# EAGLE design emonGLCD_V1.5 (EAGLE 6.5.0)
ABBREV: tx1; DRAWING_AUTHOR: Glyn Husdson; PROJECT: EmonTx V1.0
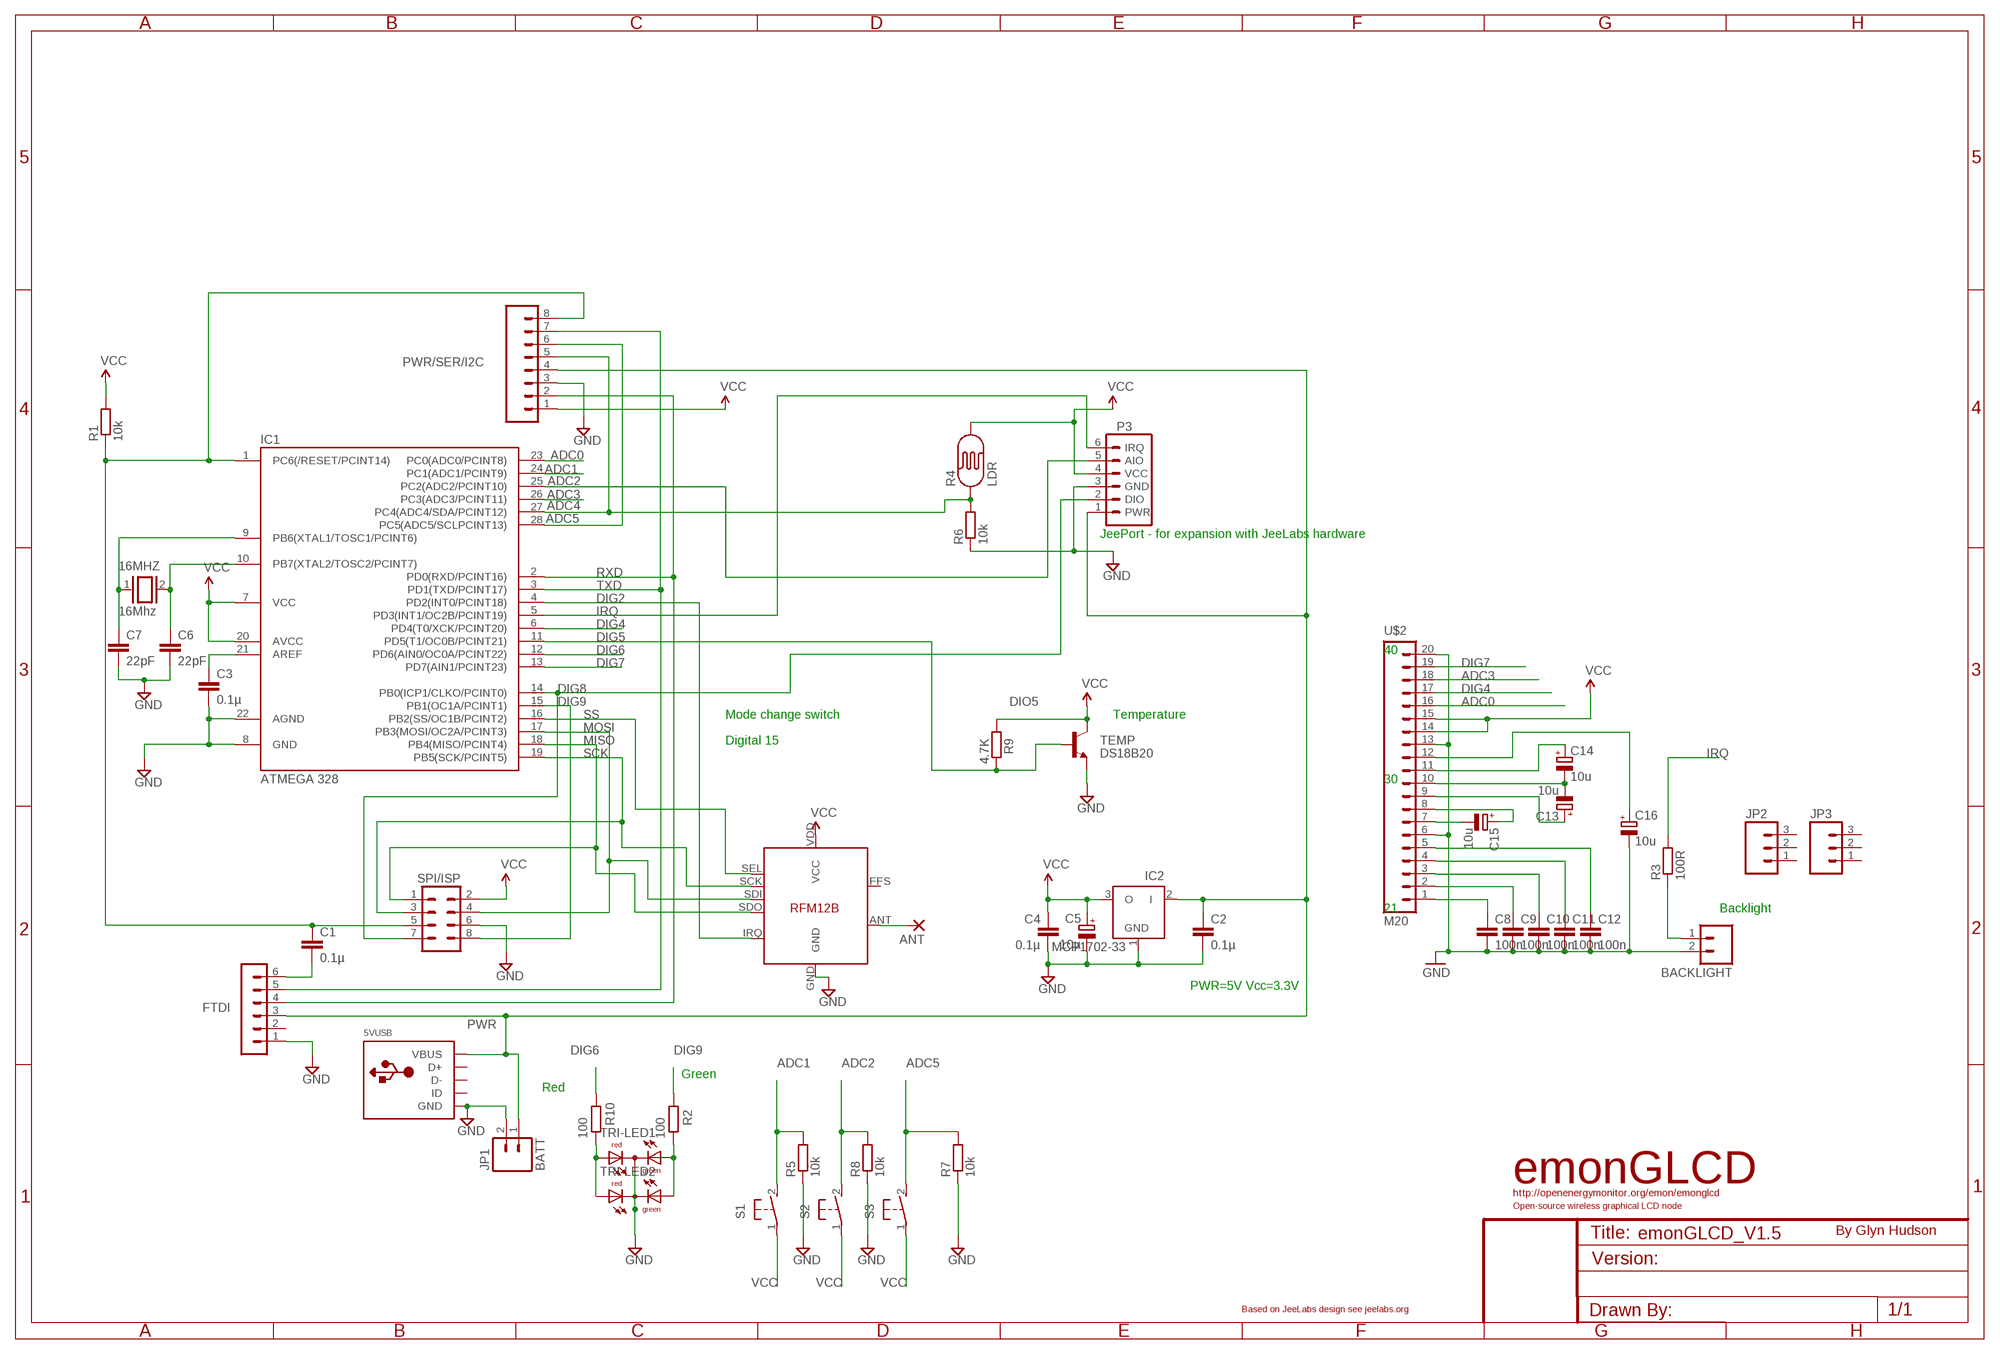
[diagram p0: schematic, sheet 1]

## Parts
5VUSB  USBMOLEX  [USB-MINIB-THM-MOLEX]
16MHZ  16Mhz  XTAL/S  [QS]
ANT  1,6/0,8  [1,6/0,8]
BACKLIGHT  M02PTH  [1X02]
C1  0.1µ  C-EU025-024X044  [C025-024X044]
C2  0.1µ  C-EU025-024X044  [C025-024X044]
C3  0.1µ  C-EU025-024X044  [C025-024X044]
C4  0.1µ  C-EU025-024X044  [C025-024X044]
C5  10µ  CPOL-EUE1.8-4  [E1,8-4]
C6  22pF  C2.5/2  [C2.5-2]
C7  22pF  C2.5/2  [C2.5-2]
C8  100n  C2.5/2  [C2.5-2]
C9  100n  C2.5/2  [C2.5-2]
C10  100n  C2.5/2  [C2.5-2]
C11  100n  C2.5/2  [C2.5-2]
C12  100n  C2.5/2  [C2.5-2]
C13  10u  CPOL-EUE1.8-4  [E1,8-4]
C14  10u  CPOL-EUE1.8-4  [E1,8-4]
C15  10u  CPOL-EUE1.8-4  [E1,8-4]
C16  10u  CPOL-EUE1.8-4  [E1,8-4]
FTDI  FTDI  MA06-1  [MA06-1]
IC1  ATMEGA 328  ATMEGA48/88/168-PU  [DIL28-3]
IC2  MCP1702-33  MCP1702Z  [TO92]
JP1  BATT  M02LOCK_LONGPADS  [1X02_LOCK_LONGPADS]
JP2  M03PTH  [1X03]
JP3  M03PTH  [1X03]
P3  JEEPORT  JEEPORT-LONGPADS  [PORT6PIN]
PWR/SER/I2C  M08  [1X08]
R1  10k  R-EU_0204/7  [0204/7]
R2  100  R-EU_0204/7  [0204/7]
R3  100R  R-EU_0204/7  [0204/7]
R4  LDR  PHOTOCELLPTH  [PHOTOCELL]
R5  10k  R-EU_0204/7  [0204/7]
R6  10k  R-EU_0204/7  [0204/7]
R7  10k  R-EU_0204/7  [0204/7]
R8  10k  R-EU_0204/7  [0204/7]
R9  4.7K  R-EU_0204/7  [0204/7]
R10  100  R-EU_0204/7  [0204/7]
S1  31-XX  [B3F-31XX]
S2  31-XX  [B3F-31XX]
S3  31-XX  [B3F-31XX]
SV7  SPI/ISP  MA04-2  [MA04-2]
TEMP  DS18B20  TRANSISTOR_NPNTO92  [TO-92]
TRI-LED1  DUOLED5MM  [DUOLED5MM]
TRI-LED2  DUOLED5MM  [DUOLED5MM]
U$1  RFM12B  [RFM12B]
U$2  M20  [1X20]

## Nets
ADC0: IC1.23(PC0(ADC0/PCINT8)) U$2.16
ADC1: IC1.24(PC1(ADC1/PCINT9)) R5.2 S1.2(S)
ADC2: IC1.25(PC2(ADC2/PCINT10)) P3.5(AIO) R8.2 S2.2(S)
ADC3: IC1.26(PC3(ADC3/PCINT11)) U$2.18
ADC4: IC1.27(PC4(ADC4/SDA/PCINT12)) PWR/SER/I2C.5 R4.1 R6.2
ADC5: IC1.28(PC5(ADC5/SCLPCINT13)) PWR/SER/I2C.6 R7.2 S3.2(S)
DIG2: IC1.4(PD2(INT0/PCINT18)) U$1.IRQ
DIG4 [power]: IC1.6(PD4(T0/XCK/PCINT20)) U$2.17
DIG5: IC1.11(PD5(T1/OC0B/PCINT21)) R9.2 TEMP.2(B)
DIG6: IC1.12(PD6(AIN0/OC0A/PCINT22)) R10.2
DIG7: IC1.13(PD7(AIN1/PCINT23)) U$2.19
DIG8: IC1.14(PB0(ICP1/CLKO/PCINT0)) P3.2(DIO) SV7.7
DIG9: IC1.15(PB1(OC1A/PCINT1)) R2.2 SV7.8
GND [power]: 5VUSB.GND BACKLIGHT.2 C2.2 C3.2 C4.2 C5.- C6.2 C7.2 C8.2 C9.2 C10.2 C11.2 C12.2 C16.- FTDI.1 IC1.8(GND) IC1.22(AGND) IC2.1(GND) JP1.2 P3.3(GND) PWR/SER/I2C.3 R5.1 R6.1 R7.1 R8.1 SV7.6 TEMP.1(E) TRI-LED1.K(C) TRI-LED2.K(C) U$1.GND U$2.6 U$2.13 U$2.20
IRQ: IC1.5(PD3(INT1/OC2B/PCINT19)) P3.6(IRQ) R3.2
MISO: IC1.18(PB4(MISO/PCINT4)) SV7.1 U$1.SDO
MOSI: IC1.17(PB3(MOSI/OC2A/PCINT3)) SV7.4 U$1.SDI
N$1: 16MHZ.2 C6.1 IC1.10(PB7(XTAL2/TOSC2/PCINT7))
N$2: C8.1 U$2.1
N$3: C9.1 U$2.2
N$4: C13.- C14.- U$2.10
N$5: C10.1 U$2.3
N$6: C11.1 U$2.4
N$7: C12.1 U$2.5
N$8: R10.1 TRI-LED1.AR TRI-LED2.AR
N$12: 16MHZ.1 C7.1 IC1.9(PB6(XTAL1/TOSC1/PCINT6))
N$13: ANT.1(P) U$1.ANT
N$14: R2.1 TRI-LED1.AG TRI-LED2.AG
N$15: C1.2 FTDI.6
N$17: BACKLIGHT.1 R3.1
N$19: C3.1 IC1.21(AREF)
N$20: C14.+ U$2.11
N$22: C13.+ U$2.9
N$23: C15.- U$2.7
N$27: C15.+ U$2.8
N$28: C16.+ U$2.12
PWR [power]: 5VUSB.VBUS C2.1 FTDI.3 IC2.2(I) JP1.1 P3.1(PWR) PWR/SER/I2C.4
RST: C1.1 IC1.1(PC6(/RESET/PCINT14)) PWR/SER/I2C.8 R1.1 SV7.5
RXD: FTDI.4 IC1.2(PD0(RXD/PCINT16)) PWR/SER/I2C.2
SCK: IC1.19(PB5(SCK/PCINT5)) SV7.3 U$1.SCK
SS: IC1.16(PB2(SS/OC1B/PCINT2)) U$1.SEL
TXD: FTDI.5 IC1.3(PD1(TXD/PCINT17)) PWR/SER/I2C.7
VCC [power]: C4.1 C5.+ IC1.7(VCC) IC1.20(AVCC) IC2.3(O) P3.4(VCC) PWR/SER/I2C.1 R1.2 R4.2 R9.1 S1.1(P) S2.1(P) S3.1(P) SV7.2 TEMP.3(C) U$1.VDD(VCC) U$2.14 U$2.15
Unconnected: 5VUSB.D+ 5VUSB.D- 5VUSB.ID FTDI.2 JP2.1 JP2.2 JP2.3 JP3.1 JP3.2 JP3.3 U$1.FFS

## Notes on the sheet
- JeePort - for expansion with JeeLabs hardware
- 40
- DIO5
- Mode change switch | Temperature
- Digital 15
- 30
- 21 | Backlight
- PWR=5V Vcc=3.3V
- Green
- Red
- emonGLCD
- http://openenergymonitor.org/emon/emonglcd
- Open-source wireless graphical LCD node
- By Glyn Hudson
- Based on JeeLabs design see jeelabs.org

## Library data of the parts
5VUSB = adafruit:USB: USB Connectors USBMINIB - Surface Mount Female Mini-B USB Connector 4UConnector: 06564 By microbuilder.eu Thru-hole RA Female Mini-B USB Connector 4UConnector: 18732 By ladyada.net
16MHZ = special:XTAL/S: CRYSTAL
ANT = JeeLabs:1,6/0,8: THROUGH-HOLE PAD
BACKLIGHT JP1 = SparkFun:M02: Header 2 Standard 2-pin 0.1" header. Use with straight break away headers (SKU : PRT-00116), right angle break away headers (PRT-00553), swiss pins (PRT-00743), machine pins (PRT-00117), and female headers (PRT-00115). Molex polarized connector foot print use with SKU : PRT-08233 with associated crimp pins and housings.
C1-C4 = resistor:C-EU: CAPACITOR, European symbol
C5 C13-C16 = resistor:CPOL-EU: POLARIZED CAPACITOR, European symbol
C6-C12 = capacitor-wima:C: CAPACITOR naming: grid - package width
FTDI = JeeLabs:MA06-1: PIN HEADER
IC1 = atmega8:ATMEGA48/88/168-PU
IC2 = JeeLabs:MCP1702: 200 mA, Low Power Low Dropout Voltage Regulator
JP2 JP3 = SparkFun:M03: Header 3 Standard 3-pin 0.1" header. Use with straight break away headers (SKU : PRT-00116), right angle break away headers (PRT-00553), swiss pins (PRT-00743), machine pins (PRT-00117), and female headers (PRT-00115). Molex polarized connector foot print use with SKU : PRT-08232 with associated crimp pins and housings.
P3 = JeeParts:JEEPORT: PIN HEADER
PWR/SER/I2C = SparkFun:M08: Header 8 Standard 8-pin 0.1" header. Use with straight break away headers (SKU : PRT-00116), right angle break away headers (PRT-00553), swiss pins (PRT-00743), machine pins (PRT-00117), and female headers (PRT-00115).
R1 R5-R8 = resistor:R-EU_: RESISTOR, European symbol
R2 R3 R9 R10 = rcl:R-EU_: RESISTOR, European symbol
R4 = SparkFun:PHOTOCELL: Photocell Also known as a CdS photoresistor. This is a low cost way to detect light levels. Resistance decreases with more incoming light. SparkFun SKU: SEN-09088
S1-S3 = switch-omron:31-XX: OMRON SWITCH
SV7 = JeeLabs:MA04-2: PIN HEADER
TEMP = SparkFun:TRANSISTOR_NPN: Transistor NPN BJT configuration in SOT23 package. MMBT2222 is the common NPN we use. Double check BCE configuration again layout.
TRI-LED1 TRI-LED2 = led:DUOLED5MM: DUO LED 2 colors, 5 mm, round
U$1 = JeeLabs:RFM12B
U$2 = SparkFun:M20: This is just like the LOCK variant in that the holes are staggared by 5 mil, but except for the last two holes. They are not altered from the "standard" footprint layout. This is used for a special purpose on the layout of our Graphic LCD Backpack. Make sure you want to use this device before selecting it for you project!

## Net classes
0 default: width 0.254 mm, drill 0.6 mm, clearance 0.254 mm
1 power: width 0.305 mm, drill 0.6 mm, clearance 0.254 mm

## Board
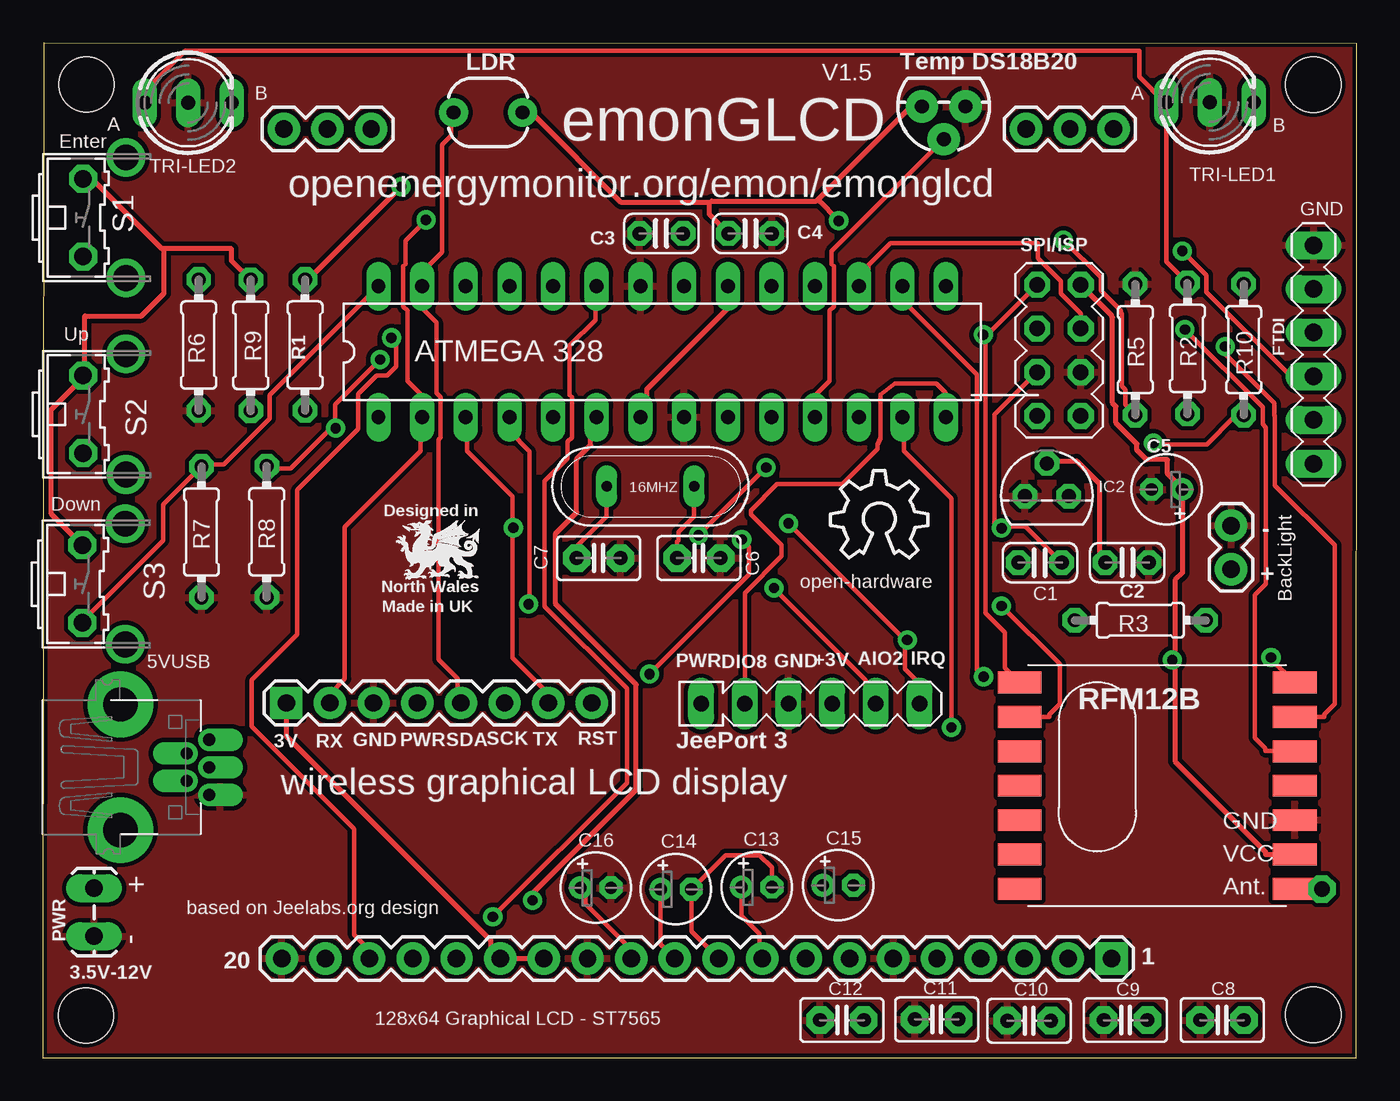
[diagram p1: board, top side]
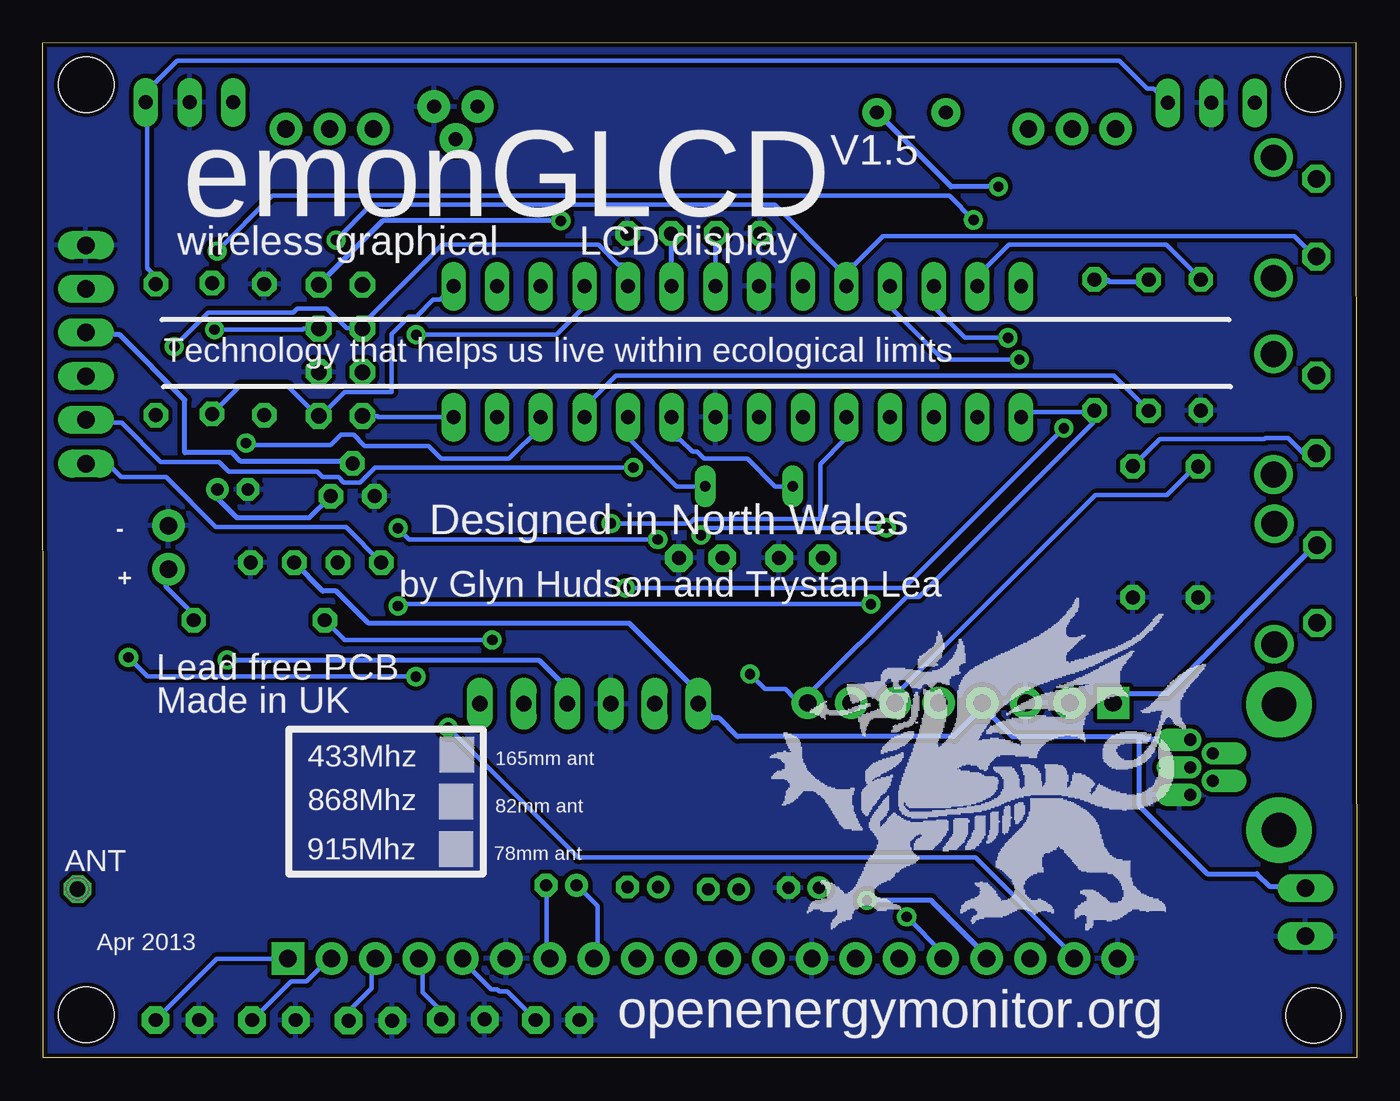
[diagram p2: board, bottom side, seen from below]

Size 76.4 x 59.04 mm. Coordinates in mm from the lower left corner, seen from the top.
Outline: 0.03,59.04 76.4,59.03 76.38,0 0,0 0.03,59.04
Copper layers (1*16): Top 0.035mm / dielectric 1.5mm / Bottom 0.035mm
Design rules "default": minimum track width 10mil, minimum drill 0.6mm, track to track 10mil, track to pad 10mil, pad to pad 10mil, via to via 10mil, smd to smd 10mil, copper to edge 10mil, drill to drill 10mil, minimum pad ring 12mil, minimum via ring 10mil, stop-mask expansion 4mil, vias tented up to drill 25mil, thermal gap 10mil
Holes 3.2 mm at 2.54,56.62 73.89,56.61 73.88,2.51 2.49,2.47

### Footprints (pad centres in the part's own frame; a part is rotated, then mirrored left to right if it is on the bottom)
USB-MINIB-THM-MOLEX = drill 0.7 offset: D+ 0,9.72; D- -0.8,8.42; GND 1.6,9.72; ID 0.8,8.42; VBUS -1.6,9.72 | drill 2 pad 3.81: GND1 -3.65,4.57; GND4 3.65,4.57
QS = drill 0.61 long: 1 -2.54,0; 2 2.54,0
1,6/0,8 = drill 0.9 pad 1.6 octagon: 1 0,0
1X02 = drill 1.016 pad 1.88: 1 0,0; 2 2.54,0
C025-024X044 = drill 0.813 octagon: 1 -1.27,0; 2 1.27,0
E1,8-4 = drill 0.711 pad 1.168: + -0.889,0 | drill 0.711 pad 1.168 octagon: - 0.889,0
C2.5-2 = drill 0.813 pad 1.6 octagon: 1 -1.27,0; 2 1.27,0
MA06-1 = drill 1.016 long: 1 0,0; 2 2.54,0; 3 5.08,0; 4 7.62,0; 5 10.16,0; 6 12.7,0
DIL28-3 = drill 0.813 long: 1 -16.51,-3.81; 2 -13.97,-3.81; 3 -11.43,-3.81; 4 -8.89,-3.81; 5 -6.35,-3.81; 6 -3.81,-3.81; 7 -1.27,-3.81; 8 1.27,-3.81; 9 3.81,-3.81; 10 6.35,-3.81; 11 8.89,-3.81; 12 11.43,-3.81; 13 13.97,-3.81; 14 16.51,-3.81; 15 16.51,3.81; 16 13.97,3.81; 17 11.43,3.81; 18 8.89,3.81; 19 6.35,3.81; 20 3.81,3.81; 21 1.27,3.81; 22 -1.27,3.81; 23 -3.81,3.81; 24 -6.35,3.81; 25 -8.89,3.81; 26 -11.43,3.81; 27 -13.97,3.81; 28 -16.51,3.81
TO92 = drill 0.813 octagon: 1 -1.27,0; 2 0,1.905; 3 1.27,0
1X02_LOCK_LONGPADS = drill 1.016 long: 1 -0.127,0; 2 2.667,0
1X03 = drill 1.016 pad 1.88: 1 0,0; 2 2.54,0; 3 5.08,0
PORT6PIN = drill 0.9 long: 1 -6.35,0; 2 -3.81,0; 3 -1.27,0; 4 1.27,0; 5 3.81,0; 6 6.35,0
1X08 = drill 1.016 pad 1.88 square: 1 0,0 | drill 1.016 pad 1.88: 2 2.54,0; 3 5.08,0; 4 7.62,0; 5 10.16,0; 6 12.7,0; 7 15.24,0; 8 17.78,0
0204/7 = drill 0.813 octagon: 1 -3.81,0; 2 3.81,0
PHOTOCELL = drill 0.8 pad 1.676: 1 -2,0; 2 2,0
B3F-31XX = drill 1.016 octagon: 1 -2.261,-1.245; 2 2.261,-1.245 | drill 1.499 pad 2.159: 3 -3.505,1.245; 4 3.505,1.245
MA04-2 = drill 0.9 octagon: 1 -3.81,-1.27; 2 -3.81,1.27; 3 -1.27,-1.27; 4 -1.27,1.27; 5 1.27,-1.27; 6 1.27,1.27; 7 3.81,-1.27; 8 3.81,1.27
TO-92 = drill 0.813 pad 1.88: 1 -1.27,0; 2 0,1.905; 3 1.27,0
DUOLED5MM = drill 0.813 long: AG -2.54,0; AR 2.54,0; K 0,0
RFM12B = smd 2.54 x 1.27: ANT 8,-6; FFS -8,2; GND 8,-2; IRQ -8,4; P$8 -8,0; P$9 -8,-2; P$10 -8,-4; P$12 -8,-6; P$16 8,0; SCK 8,4; SDI 8,2; SDO -8,6; SEL 8,6; VDD 8,-4
1X20 = drill 1.016 pad 1.88 square: 1 0,0 | drill 1.016 pad 1.88: 2 2.54,0; 3 5.08,0; 4 7.62,0; 5 10.16,0; 6 12.7,0; 7 15.24,0; 8 17.78,0; 9 20.32,0; 10 22.86,0; 11 25.4,0; 12 27.94,0; 13 30.48,0; 14 33.02,0; 15 35.56,0; 16 38.1,0; 17 40.64,0; 18 43.18,0; 19 45.72,0; 20 48.26,0

### Placement (x,y rotation side)
5VUSB  -0.06,16.92 270 top
16MHZ  35.33,33.24 0 top
ANT  74.38,9.84 0 bottom
BACKLIGHT  69.1,28.43 90 top
C1  57.99,28.81 180 top
C2  63.05,28.82 0 top
C3  35.97,47.96 180 top
C4  41.13,47.96 0 top
C5  65.36,33.07 180 top
C6  38.15,29.08 0 top
C7  32.31,29.08 0 top
C8  68.58,2.21 180 top
C9  62.96,2.21 180 top
C10  57.35,2.17 180 top
C11  51.98,2.25 180 top
C12  46.47,2.21 180 top
C13  41.51,9.94 0 top
C14  36.82,9.82 0 top
C15  46.25,10.05 0 top
C16  32.15,9.9 0 top
FTDI  73.9,47.28 270 top
IC1  36.02,41.08 0 top
IC2  58.39,32.67 0 top
JP1  2.98,9.75 270 top
JP2  57.18,54.04 0 top
JP3  14.01,54.04 0 top
P3  44.63,20.61 0 top
PWR/SER/I2C  14.15,20.65 0 top
R1  15.24,41.47 90 top
R2  66.57,41.27 270 top
R3  63.82,25.46 180 top
R4  25.89,54.99 0 top
R5  63.53,41.21 270 top
R6  9.05,41.47 90 top
R7  9.22,30.6 90 top
R8  13.01,30.61 90 top
R9  12.08,41.45 270 top
R10  69.83,41.2 270 top
S1  3.58,48.87 270 top
S2  3.58,37.44 270 top
S3  3.54,27.57 270 top
SV7  59.09,41.16 270 top
TEMP  52.39,55.35 180 top
TRI-LED1  67.87,55.59 0 top
TRI-LED2  8.44,55.56 0 top
U$1  64.81,15.84 0 top
U$2  62.15,5.79 180 top
U$3  Open-source Hardware  [OSHW_8X200_NOTEXT]  45.8,29.08 0 top

### Tracks (layer width: path | path; a pad name or v marks a point on that pad's centre or on a via)
ADC0  (via drill 0.6)
  Top 0.254: IC1.23 32.13,44.81 32.13,42.93 30.63,41.43 30.63,38.56 30.76,38.44 30.76,36.1 30.5,35.84 30.5,34.88 29.18,33.56 29.18,26.27 33.96,21.49 33.96,16.01 v26.16,8.21
  Bottom 0.254: v26.16,8.21 24.05,6.1 24.05,5.8 U$2.16
ADC1  (via drill 0.6)
  Top 0.254: v59.36,47.58 61.52,45.42 61.52,44.63 62.69,43.46 62.69,43.36 62.74,43.31 62.74,39.1 62.94,38.89 62.94,38 63.52,37.42 R5.2
  Bottom 0.254: S1.2 2.44,46.61 3.63,47.81 27.56,47.81 29.21,46.16 29.67,46.16 29.74,46.06 IC1.24 29.67,45.88 29.77,45.95 30.15,45.95 33.83,49.64 57.3,49.64 v59.36,47.58
ADC2  (via drill 0.6)
  Top 0.254: v19.61,40.62 16.99,38 16.99,36.89 16.88,36.77 | 16.88,36.77 14.4,34.29 13.03,34.29 13.03,34.4 R8.2 | v42.52,27.34 42.52,27.31 47.83,22 47.83,21.24 48.44,20.63 P3.5 | v17.02,36.63 16.88,36.77
  Bottom 0.254: S2.2 3.1,35.18 3.96,36.05 5.31,36.05 5.36,36 11.43,36 13,34.42 R8.2 | IC1.25 27.13,43.59 27.02,43.59 24.05,40.62 v19.61,40.62 | v42.52,27.34 26.31,27.34 v17.02,36.63
ADC3  (via drill 0.6)
  Top 0.254: v20.27,41.89 20.55,41.61 20.55,40.21 20.01,39.68 19.4,39.68 18.34,38.61 18.34,36.58 14.78,33.02 14.78,24.64 12.14,22 12.14,19.28 18.11,13.31 18.11,7.17 18.95,6.33 18.95,5.8 U$2.18
  Bottom 0.254: IC1.26 24.59,43.59 24.48,43.59 22.78,41.89 v20.27,41.89
ADC4
  Top 0.254: R4.1 23.88,54.97 23.75,54.84 23.75,53.65 23.21,53.12 23.21,46.87 22.05,45.7 IC1.27 22.1,44.79 22.1,43.57 22.88,42.78 22.88,38.69 23.14,38.44 23.14,36.1 23.01,35.97 23.01,23.17 24.1,22.08 24.1,20.83 24.28,20.66 PWR/SER/I2C.5
  Bottom 0.254: IC1.27 22.05,45.47 20.22,47.3 11.07,47.3 9.07,45.29 R6.2
ADC5
  Top 0.254: S3.2 2.31,25.33 2.31,25.43 6.98,30.1 6.98,32.19 9.19,34.4 R7.2 9.3,34.5 9.3,34.52 10.51,34.52 13.18,37.19 13.18,38.56 IC1.28
  Bottom 0.254: PWR/SER/I2C.6 26.82,20.66 26.82,21.44 26.49,21.44 15.19,32.75 11.02,32.75 9.37,34.4 R7.2
DIG2  (via drill 0.6)
  Top 0.254: v55.75,26.29 59.13,22.92 59.13,20.6 58.52,19.99 58.52,19.84 56.82,19.84 U$1.IRQ | v28.24,26.4 28.29,26.45 28.29,35.29 27.13,36.45 IC1.4
  Bottom 0.254: v55.75,26.29 55.65,26.4 v28.24,26.4
DIG4  (via drill 0.6)
  Top 0.305: IC1.6 31.85,36.91 31.85,35.64 31.04,34.83 31.04,31.73 29.82,30.51 29.82,26.4 34.49,21.72 34.49,15.6 28.47,9.58 v28.47,9.17
  Bottom 0.305: v28.47,9.17 24.74,9.17 21.51,5.95 21.51,5.8 U$2.17
DIG5
  Top 0.254: IC1.11 44.91,38.54 45.74,39.37 45.74,43.46 46,43.72 46,46.06 45.87,46.18 45.87,46.92 52.37,53.42 TEMP.2
  Bottom 0.254: IC1.11 44.91,37.85 43.08,39.68 14.12,39.68 R9.2
DIG6  (via drill 0.6)
  Top 0.254: v64.59,35.77 64.59,35.69 67.69,35.69 69.26,37.27 69.26,37.39 69.82,37.39 R10.2
  Bottom 0.254: v64.59,35.77 64.46,35.64 59.66,35.64 59.05,36.25 58.34,36.25 57.68,35.59 53.97,35.59 53.24,34.85 49.28,34.85 47.45,36.68 IC1.12
DIG7  (via drill 0.6)
  Top 0.254: IC1.13 50.06,37.19 50.06,35.31 52.83,32.54 v52.83,19.23
  Bottom 0.254: v52.83,19.23 45.26,11.66 22.17,11.66 16.43,5.92 16.43,5.8 U$2.19
DIG8
  Top 0.254: P3.2 40.82,27.06 42.95,29.19 42.95,29.82 41.17,31.6 41.17,31.86 42.7,33.38 46.51,33.38 48.54,35.41 48.54,35.67 48.72,36.05 48.72,38.59 49.55,39.22 51.97,39.22 52.48,38.71 52.48,37.32 IC1.14
  Bottom 0.254: IC1.14 52.55,37.29 56.9,37.29 56.95,37.34 57.81,37.34 SV7.7
DIG9
  Bottom 0.254: IC1.15 53.31,44.1 53.69,44.1 54.66,43.13 55.09,43.13 56.11,42.12 56.11,38.74 58.85,38.74 60.22,37.37 60.35,37.37 SV7.8 60.48,37.39 62.15,39.07 64.95,39.07 66.55,37.47 R2.2
GND
  pour Bottom (isolate 0.254): 78.7,61.1 78.53,-1.57 -2.22,-1.73 -2.03,60.94
  pour Top: -3.21,62.8 80.29,62.8 80.29,-3.1 -3.21,-3.1
IRQ  (via drill 0.6)
  Top 0.254: 50.14,24.31 v43.36,31.09 | 50.14,24.31 50.14,22.64 50.98,21.8 50.98,20.63 P3.6 | v50.27,24.31 50.14,24.31
  Bottom 0.254: IC1.5 29.67,35.97 29.77,35.97 31.19,34.55 31.19,31.35 38.53,31.35 38.78,31.09 v43.36,31.09 | v50.27,24.31 58.85,24.31 59.99,25.46 R3.2
MISO  (via drill 0.6)
  Top 0.254: 54.81,41.97 54.81,25.89 55.96,24.74 55.96,22.69 56.79,21.85 U$1.SDO | 54.81,41.97 57.81,44.96 SV7.1 | v54.69,42.07 54.71,42.04 54.81,41.97
  Bottom 0.254: IC1.18 44.91,43.59 45.01,43.59 46.53,42.07 v54.69,42.07
MOSI  (via drill 0.6)
  Top 0.254: v66.42,42.37 70.94,37.85 70.94,36.86 71.12,36.68 71.12,27.56 70.48,26.93 70.48,18.62 71.09,18.01 71.09,17.86 72.8,17.86 U$1.SDI | IC1.17 48.01,45.45 48.01,46.11 49.3,47.4 57.86,47.4 57.86,46.54 59.21,45.19 59.21,44.45 60.35,43.31 60.35,42.45 SV7.4
  Bottom 0.254: v66.42,42.37 61.29,42.37 61.24,42.42 60.37,42.42 SV7.4
N$1
  Top 0.254: 16MHZ.2 37.87,31.5 36.96,30.59 36.96,30.1 36.88,30.03 C6.1
  Bottom 0.254: IC1.10 42.37,35.97 42.26,35.97 39.55,33.25 16MHZ.2
N$2
  Bottom 0.254: C8.1 66.29,5.77 62.15,5.77 U$2.1
N$3
  Bottom 0.254: C9.1 64.21,2.21 61.98,4.45 61.06,4.45 59.74,5.77 59.61,5.77 U$2.2
N$4
  Top 0.254: U$2.10 37.7,7.37 C14.- 39.68,11.79 41.68,11.79 42.4,11.07 C13.-
N$5
  Bottom 0.254: C10.1 58.62,2.19 58.62,2.82 58.5,2.82 57.28,4.04 57.28,5.77 57.07,5.77 U$2.3
N$6
  Bottom 0.254: C11.1 53.26,2.27 53.26,2.9 53.39,2.9 54.3,3.81 54.3,5.77 54.51,5.77 U$2.4
N$7
  Bottom 0.254: C12.1 47.75,2.21 49.4,3.87 49.86,3.87 49.99,3.99 50.34,3.99 51.97,5.62 51.97,5.77 U$2.5
N$8
  Bottom 0.254: TRI-LED2.AR 11,55.58 11.78,56.37 12.17,56.37 13.79,57.99 68.6,57.99 70.41,56.19 TRI-LED1.AR 70.33,55.5 70.33,45.95 69.98,45.6 69.85,45.6 69.85,45.04 R10.1
N$12
  Top 0.254: 16MHZ.1 32.79,31.5 31.06,29.77 31.06,29.09 C7.1
  Bottom 0.254: IC1.9 39.83,35.97 39.34,35.97 38.63,35.26 38.35,35.26 37.95,34.85 35.43,34.85 33.83,33.25 16MHZ.1
N$13
  Top 0.254: U$1.ANT 72.82,9.83 ANT.1
N$14
  Top 0.254: TRI-LED2.AG 5.92,55.58 6.48,56.14 6.48,56.8 8.28,58.6 63.75,58.6 63.75,57.08 65.23,55.61 TRI-LED1.AG 65.33,55.48 65.33,46.31 66.55,45.09 R2.1
N$15
  Bottom 0.254: C1.2 56.72,28.83 58.77,30.89 66.34,30.89 69.24,33.79 71.86,33.79 72.64,34.57 FTDI.6
N$17
  Bottom 0.254: R3.1 67.64,25.48 67.64,26.04 67.87,26.04 69.26,27.44 69.26,28.43 BACKLIGHT.1
N$19
  Bottom 0.254: IC1.21 37.29,47.96 C3.1
N$20
  Top 0.254: C14.+ 35.93,6.61 U$2.11
N$22
  Top 0.254: C13.+ 40.62,8.28 41.68,7.22 41.68,5.94 U$2.9
N$23
  Bottom 0.254: C15.- 47.12,10.04 47.12,5.8 46.91,5.8 U$2.7
N$27
  Bottom 0.254: C15.+ 45.34,10.04 44.14,8.84 44.14,5.8 44.35,5.8 U$2.8
N$28
  Top 0.254: C16.+ 31.27,9.89 31.55,9.61 31.55,8.97 34.19,6.33 34.19,5.8 U$2.12
PWR
  Top 0.305: C2.1 61.77,28.83 61.44,29.16 61.44,33.41 60.12,34.73 58.39,34.73 58.39,34.6 IC2.2
  Bottom 0.305: FTDI.3 73.76,42.07 71.93,42.07 68.15,38.28 68.15,35.21 65.4,35.21 64.9,34.7 59.1,34.7 59,34.6 58.39,34.6 IC2.2 | 12.65,18.7 20.01,18.7 21.74,20.43 21.74,20.63 PWR/SER/I2C.4 21.82,20.3 21.84,20.3 23.44,18.7 35.99,18.7 37.06,19.77 37.44,19.77 P3.1 38.3,20.76 38.3,21.29 42.29,25.28 57.45,25.28 59.33,27.16 60.12,27.16 61.77,28.81 C2.1 | 12.65,18.7 12.47,18.7 12.32,18.55 9.7,18.55 9.68,18.52 5VUSB.VBUS | 12.65,18.7 12.65,14.69 8.69,10.72 5.79,10.72 5.05,9.99 3.1,9.99 3,9.89 JP1.1
RST  (via drill 0.6)
  Top 0.254: 55.75,30.92 55.35,30.92 55.35,37.42 57.81,39.88 SV7.5 | 55.75,30.92 57.15,30.92 59.23,28.83 C1.1 | v40.64,30.15 41.07,29.72 41.07,28.12 v35.28,22.33 | v55.75,30.82 55.75,30.92
  Bottom 0.254: IC1.1 19.2,37.57 15.32,37.57 15.24,37.65 R1.1 15.34,37.47 15.34,36.94 25.45,26.83 26.19,26.83 31.57,21.44 31.9,21.44 31.9,20.66 PWR/SER/I2C.8 32,20.99 32.74,20.99 33.22,21.47 34.42,21.47 v35.28,22.33 | v55.75,30.82 55.09,30.15 v40.64,30.15
RXD  (via drill 0.6)
  Top 0.254: PWR/SER/I2C.2 16.69,21.19 17.55,22.05 17.55,30.89 21.97,35.31 21.97,37.19 IC1.2 22,37.37 22,38.59 21.21,39.37 21.21,43.46 20.95,43.72 20.95,46.06 21.08,46.18 21.08,47.55 v22.27,48.75 | v66.27,46.94 67.66,45.55 67.66,44.56 72.41,39.81 72.41,39.68 73.89,39.68 FTDI.4
  Bottom 0.254: v66.27,46.94 63.07,50.14 23.67,50.14 v22.27,48.75
SCK  (via drill 0.6)
  Top 0.254: v68.76,41.38 68.76,40.95 71.6,38.1 71.6,37.39 71.65,37.34 71.65,33.3 75.13,29.82 75.13,20.6 74.52,19.99 74.52,19.84 72.82,19.84 U$1.SCK
  Bottom 0.254: v68.76,41.38 66.78,43.36 61.85,43.36 61.62,43.59 59.89,43.59 58.75,42.45 57.83,42.45 SV7.3 57.94,42.55 53.19,47.3 44.09,47.3 42.95,46.16 42.37,46.16 IC1.19
SS  (via drill 0.6)
  Top 0.254: v71.42,23.3 71.42,23.22 72.8,21.85 U$1.SEL | v54.71,22.18 54.3,22.59 54.3,39.76 49.99,44.07 IC1.16
  Bottom 0.254: v71.42,23.3 70.31,22.18 v54.71,22.18
TXD  (via drill 0.6)
  Top 0.254: IC1.3 24.66,37.19 24.66,35.31 27.3,32.67 27.3,30.84 | 27.3,30.84 27.3,23.27 29.36,21.21 29.36,20.66 PWR/SER/I2C.7 | v38.12,30.41 v42.06,34.35 | v27.35,30.84 27.3,30.84
  Bottom 0.254: v42.06,34.35 57.07,34.35 57.94,33.48 58.9,33.48 59.21,33.79 60.12,33.79 60.45,34.12 65.58,34.12 66.14,34.68 69.54,34.68 71.83,36.96 73.74,36.96 FTDI.5 | v38.12,30.41 37.69,30.84 v27.35,30.84
VCC  (via drill 0.6)
  Top 0.305: 65.84,23.14 65.84,27.79 66.27,28.22 66.27,33.05 C5.+ 66.19,33.2 65.4,33.99 65.4,34.8 64.18,34.8 63.63,35.36 63.63,35.72 62.41,36.94 62.41,37.9 62.2,38.1 62.2,43.08 62.15,43.13 62.15,43.18 60.37,44.96 SV7.2 | 65.84,23.14 65.84,17.25 71.09,11.99 71.09,11.84 U$1.VDD | v65.68,23.14 65.84,23.14 | IC1.7 35.1,37.62 35.1,38.89 39.83,43.62 IC1.20 | 38.76,49.76 33.63,49.76 28.55,54.84 28.55,54.97 27.89,54.97 R4.2 | 38.76,49.76 38.76,49.08 39.85,47.99 C4.1 | 45.06,49.92 44.98,49.84 38.89,49.84 38.76,49.76 | 45.06,49.92 50.34,55.2 50.34,55.33 51.1,55.33 TEMP.3 | S1.1 2.97,51.14 2.97,51.01 6.91,47.07 7.03,47.07 | 7.03,47.07 10.97,47.07 10.97,46.36 12.06,45.27 R9.1 | U$2.14 29.11,5.77 26.59,5.77 U$2.15 26.52,5.92 26.03,6.41 26.03,6.84 14.15,18.72 14.15,20.63 PWR/SER/I2C.1 | S3.1 2.29,29.85 0.46,31.68 0.46,37.7 2.34,39.58 S2.1 2.44,39.81 2.44,43.16 5.71,43.16 7.03,44.48 7.03,47.07 | v20.83,50.68 15.44,45.29 R1.2 | 45.06,49.92 v46.28,48.7
  Bottom 0.305: IC2.3 60.91,31.42 65.12,31.42 66.24,32.54 66.24,33.05 C5.+ | v65.68,23.14 47.55,23.14 46.35,21.95 45.92,21.95 45.92,20.63 P3.4 | IC1.20 39.85,44.89 C4.1 | R9.1 12.09,45.24 12.17,45.17 14.38,45.17 14.48,45.27 15.24,45.27 R1.2 | PWR/SER/I2C.1 14.12,20.66 13.59,21.19 11.02,21.19 2.39,29.82 2.31,29.82 S3.1 | v20.83,50.68 23.57,50.68 27.86,54.97 R4.2 | v46.28,48.7 56.64,48.7 60.35,44.99 SV7.2

### Text on the board
_tsilk: LDR | Temp DS18B20 | B | V1.5 | A | A | B | Enter | emonGLCD | openenergymonitor.org/emon/emonglcd | GND | C3 | C4 | SPI/ISP | Up | R1 | FTDI | C5 | Down | Designed in | - | + | North Wales | open-hardware | C2 | BackLight | Made in UK | PWR | DIO8 | GND | +3V | AIO2 | IRQ | RFM12B | 3V | RX | GND | PWR | SDA | SCK | TX | RST | JeePort 3 | wireless graphical LCD display | + | PWR | based on Jeelabs.org design | - | 3.5V-12V | 1 | 20 | 128x64 Graphical LCD - ST7565
_bsilk: V1.5 | emonGLCD | wireless graphical LCD display | Technology that helps us live within ecological limits | Designed in North Wales | - | + | by Glyn Hudson and Trystan Lea | Lead free PCB | Made in UK | 165mm ant | 433Mhz | 868Mhz | 82mm ant | 78mm ant | 915Mhz | Apr 2013 | openenergymonitor.org